# Altium schematic sheet KUBODriver_Driver.SchDoc
size 420 x 297 mm; DocumentNumber: BSV.23-KUBODRIVER Э3; SheetNumber: 4; Format: A3
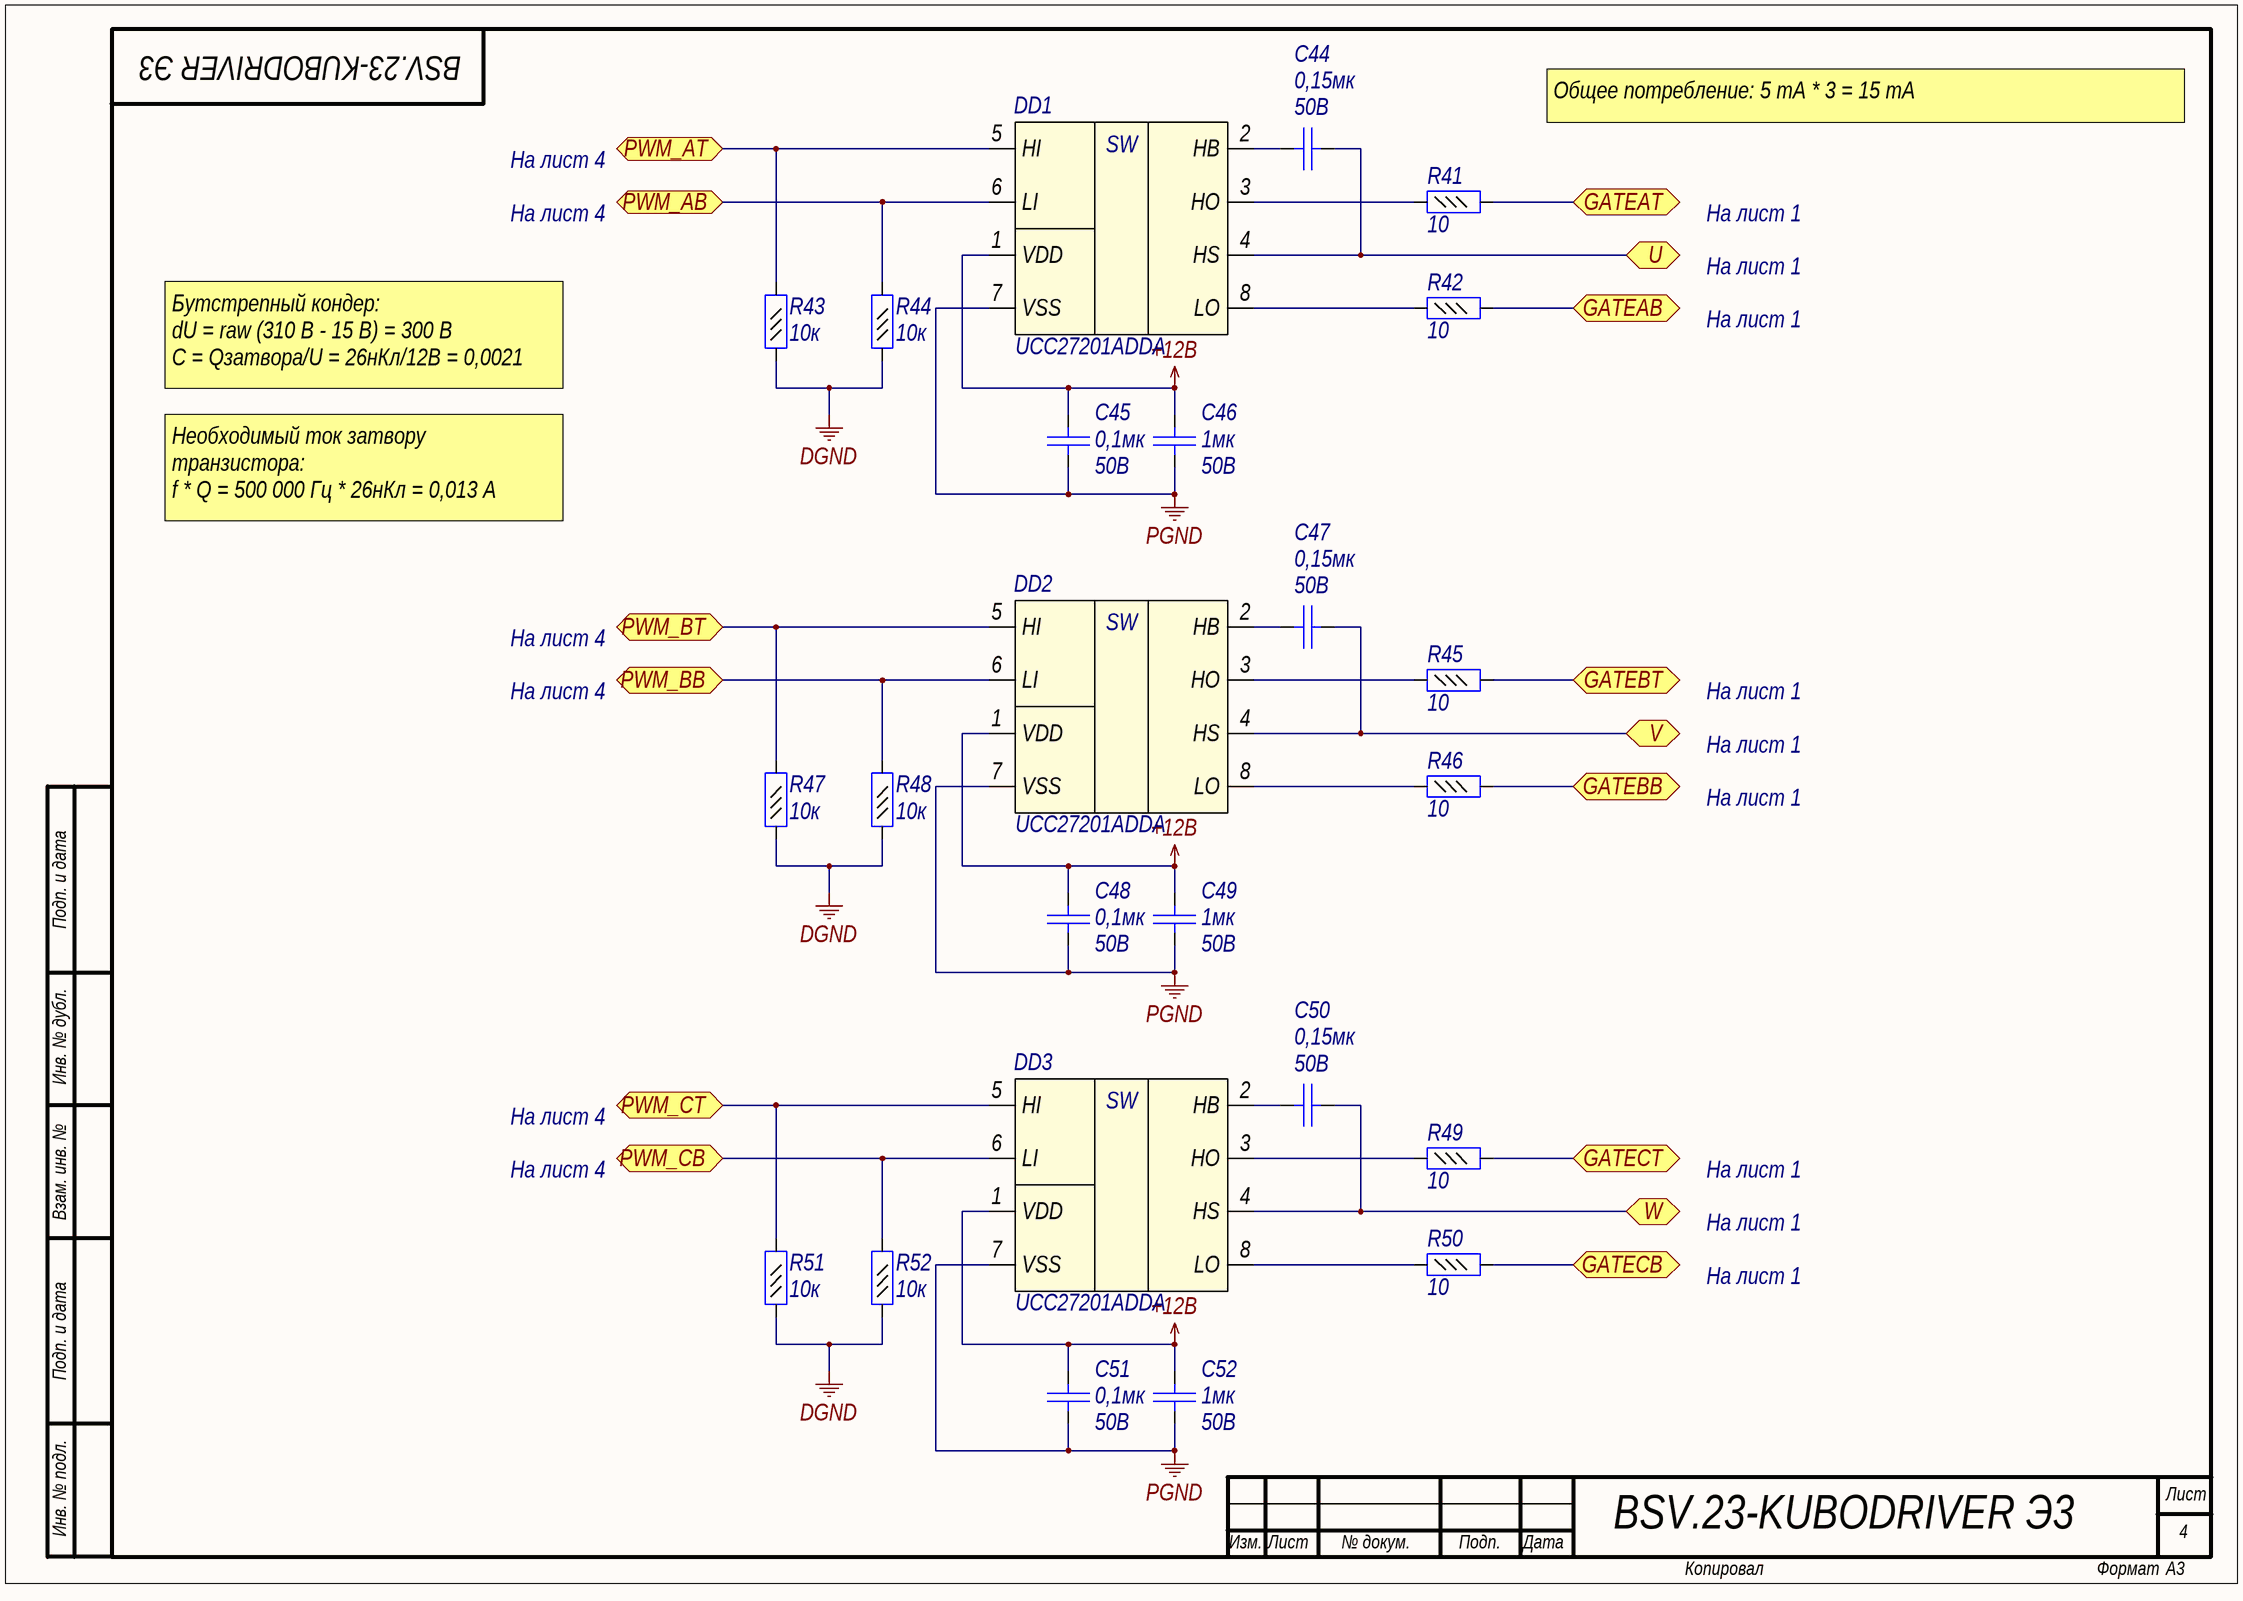
[diagram p0: KUBODriver_Driver.SchDoc]

## Parts
C44  Voltage: 50В  [C1812]  (hidden comment: 0,15мк)
C45  value 0,1мк  Voltage: 50В  [C0402]  (hidden comment: Capacitor)
C46  value 1мк  Voltage: 50B  [C0805]  (hidden comment: Capacitor)
C47  Voltage: 50В  [C1812]  (hidden comment: 0,15мк)
C48  value 0,1мк  Voltage: 50В  [C0402]  (hidden comment: Capacitor)
C49  value 1мк  Voltage: 50B  [C0805]  (hidden comment: Capacitor)
C50  Voltage: 50В  [C1812]  (hidden comment: 0,15мк)
C51  value 0,1мк  Voltage: 50В  [C0402]  (hidden comment: Capacitor)
C52  value 1мк  Voltage: 50B  [C0805]  (hidden comment: Capacitor)
DD1  Part Number: UCC27201ADDA  [HSOP8]  (hidden comment: UCC27201A)
DD2  Part Number: UCC27201ADDA  [HSOP8]  (hidden comment: UCC27201A)
DD3  Part Number: UCC27201ADDA  [HSOP8]  (hidden comment: UCC27201A)
R41  value 10  [R0402]  (hidden comment: Resistor_0,062Вт)
R42  value 10  [R0402]  (hidden comment: Resistor_0,062Вт)
R43  value 10к  [R0402]  (hidden comment: Resistor_0,062Вт)
R44  value 10к  [R0402]  (hidden comment: Resistor_0,062Вт)
R45  value 10  [R0402]  (hidden comment: Resistor_0,062Вт)
R46  value 10  [R0402]  (hidden comment: Resistor_0,062Вт)
R47  value 10к  [R0402]  (hidden comment: Resistor_0,062Вт)
R48  value 10к  [R0402]  (hidden comment: Resistor_0,062Вт)
R49  value 10  [R0402]  (hidden comment: Resistor_0,062Вт)
R50  value 10  [R0402]  (hidden comment: Resistor_0,062Вт)
R51  value 10к  [R0402]  (hidden comment: Resistor_0,062Вт)
R52  value 10к  [R0402]  (hidden comment: Resistor_0,062Вт)

## Ports
GATEAB, GATEAT, GATEBB, GATEBT, GATECB, GATECT, PWM_AB, PWM_AT, PWM_BB, PWM_BT, PWM_CB, PWM_CT, U, V, W

## Nets
+12B: C45.2 C46.2 C48.2 C49.2 C51.2 C52.2 DD1.1(VDD) DD2.1(VDD) DD3.1(VDD)
DGND: R43.1 R44.1 R47.1 R48.1 R51.1 R52.1
PGND: C45.1 C46.1 C48.1 C49.1 C51.1 C52.1 DD1.7(VSS) DD2.7(VSS) DD3.7(VSS)
GATEAB: R42.2 ; port GATEAB
GATEAT: R41.2 ; port GATEAT
GATEBB: R46.2 ; port GATEBB
GATEBT: R45.2 ; port GATEBT
GATECB: R50.2 ; port GATECB
GATECT: R49.2 ; port GATECT
PWM_AB: DD1.6(LI) R44.2 ; port PWM_AB
PWM_AT: DD1.5(HI) R43.2 ; port PWM_AT
PWM_BB: DD2.6(LI) R48.2 ; port PWM_BB
PWM_BT: DD2.5(HI) R47.2 ; port PWM_BT
PWM_CB: DD3.6(LI) R52.2 ; port PWM_CB
PWM_CT: DD3.5(HI) R51.2 ; port PWM_CT
U: C44.2 DD1.4(HS) ; port U
V: C47.2 DD2.4(HS) ; port V
W: C50.2 DD3.4(HS) ; port W
NetC44_1: C44.1 DD1.2(HB)
NetC47_1: C47.1 DD2.2(HB)
NetC50_1: C50.1 DD3.2(HB)
NetDD1_3: DD1.3(HO) R41.1
NetDD1_8: DD1.8(LO) R42.1
NetDD2_3: DD2.3(HO) R45.1
NetDD2_8: DD2.8(LO) R46.1
NetDD3_3: DD3.3(HO) R49.1
NetDD3_8: DD3.8(LO) R50.1

## Notes on the sheet
- Общее потребление: 5 mA * 3 = 15 mA
- На лист 4
- На лист 1
- Бутстрепный кондер:
  dU = raw (310 B - 15 B) = 300 B
  C = Qзатвора/U = 26нКл/12В = 0,0021 мкФ
- Необходимый ток затвору транзистора:
  f * Q = 500 000 Гц * 26нКл = 0,013 А
  Ток на затвор = 12В / 10 ом = 1,2 А
- Подп. и дата
- Инв. № дубл.
- Взам. инв. №
- Инв. № подл.
- Лист
- Изм.
- № докум.
- Подп.
- Дата
- Копировал
- Формат
- (in symbol driver25) SW

## Library data of the parts
C44 C47 C50 = cap285: Конденсатор; Part Name: Ceramic; Manufacture: TDK; Part Number: C4532C0G1H154J250KA; id: cap285; TKE: NP0; Value: 0,15мк
C45 C48 C51 = cap277: Конденсатор; Part Name: Ceramic; Manufacture: Murata; Part Number: GRM155R71H104KE14D; id: cap277; TKE: X7R; tga: 0,10%
C46 C49 C52 = cap151: Конденсатор; Part Name: Ceramic; Manufacture: Murata; Part Number: GRM21BR71H105K; id: cap151; TKE: X7R
DD1-DD3 = driver25: 120-V Boot, 3-A Peak, High-Frequency, High-Side and Low-Side Driver; Part Name: High-Side/Low-Side Driver; Manufacture: Texas Instruments; Logic High: 1,6B-2,5B; Logic Low: 0,8B-1,6B; Min Operating Supply Voltage: 8B; Max Operating Supply Voltage: 17B; Vbus: 120B; “A” OUTPUT: Noninverting; Maximum output current: 3A; Maximum Power Dissipation: 2,7W; id: driver25; “B” OUTPUT: Noninverting
R41 R42 R45 R46 R49 R50 = res222: Резистор; Manufacture: Yageo; Part Number: RC0402FR-0710RL; id: res222; Accuracy: 0,01; Part Name: Resistor; Power: 0,062Вт
R43 R44 R47 R48 R51 R52 = res294: Резистор; Manufacture: Yageo; Part Number: RC0402FR-0710KL; id: res294; Accuracy: 0,01; Part Name: Resistor; Power: 0,062Вт